# Altium project PCB_Project.PrjPcb
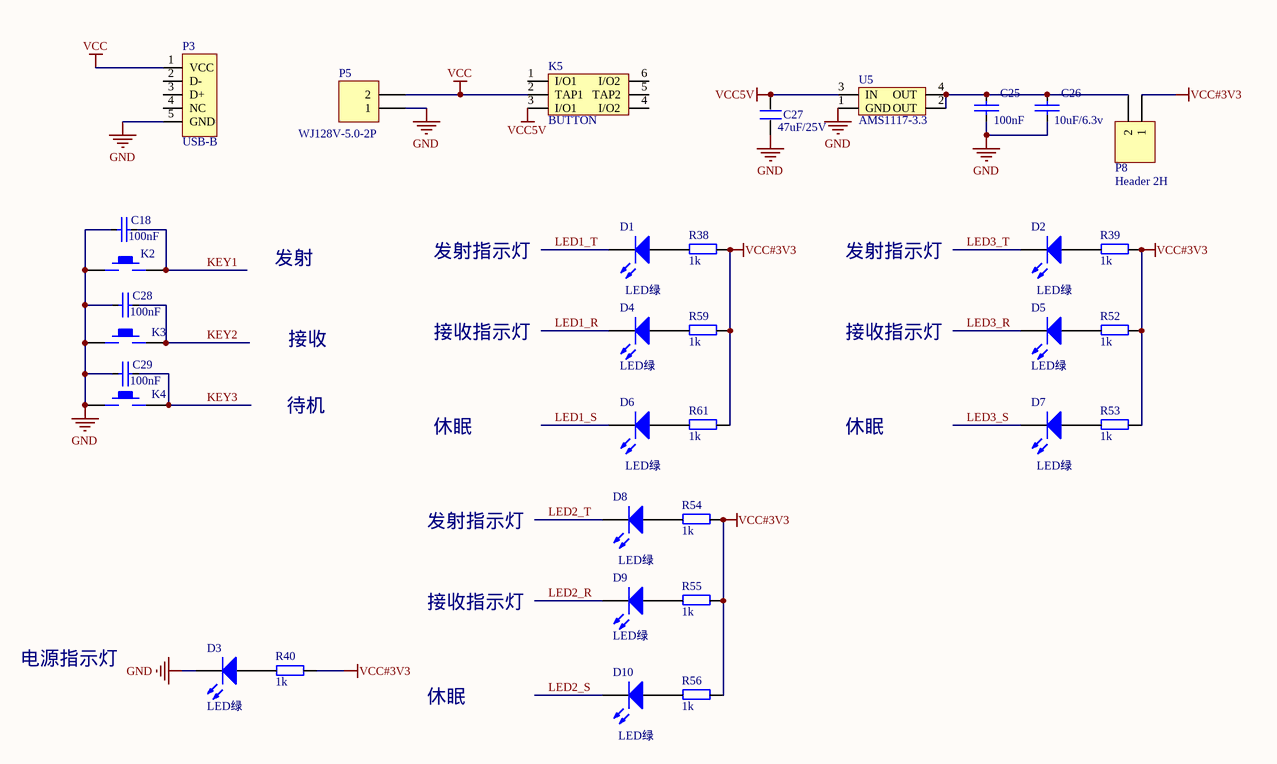
[diagram p0: Mainboard_LoRa   VCC  SCH.SchDoc]
3 sheets, 130 parts. Net scope: global (net labels, ports and power ports of the same name join across sheets).
Board file: Mainboard_LoRa  PCB.PcbDoc
Sheets:
  Mainboard_LoRa   VCC  SCH.SchDoc
  Mainboard_LoRa   MCU SCH.SchDoc
  Mainboard_LoRa   LoRa SCH.SchDoc

## Sheet Mainboard_LoRa   VCC  SCH.SchDoc
size A4

### Parts
(Parts that share a designator on the sheet are numbered #1, #2 ... from top to bottom, then left to right.)
C18#1  100nF  [CAPC_0603_2]
C25#1  100nF  [CAPC_0603_2]
C26#1  10uF/6.3v  [CAPC_0603_2]
C27#1  47uF/25V  [CAPE_D]
C28#1  100nF  [CAPC_0603_2]
C29#1  100nF  [CAPC_0603_2]
D1  LED绿  [LED_0805_G]
D2  LED绿  [LED_0805_G]
D3  LED绿  [LED_0805_G]
D4  LED绿  [LED_0805_G]
D5  LED绿  [LED_0805_G]
D6  LED绿  [LED_0805_G]
D7  LED绿  [LED_0805_G]
D8  LED绿  [LED_0805_G]
D9  LED绿  [LED_0805_G]
D10  LED绿  [LED_0805_G]
K2  K2-1102SP-E4SC-04  [SW_PB_SMD_6X6]  (value not drawn)
K3  K2-1102SP-E4SC-04  [SW_PB_SMD_6X6]  (value not drawn)
K4  K2-1102SP-E4SC-04  [SW_PB_SMD_6X6]  (value not drawn)
K5  BUTTON  [KFT DIP-8X8]
P3  USB-B  [USB_Micro_DIP41]
P5  WJ128V-5.0-2P  [KF128_2P]
P8  Header 2H  [Header 2.54X2]
R38#1  1k  [RESC_0603_2]
R39#1  1k  [RESC_0603_2]
R40#1  1k  [RESC_0603_2]
R52#1  1k  [RESC_0603_2]
R53#1  1k  [RESC_0603_2]
R54#1  1k  [RESC_0603_2]
R55#1  1k  [RESC_0603_2]
R56#1  1k  [RESC_0603_2]
R59  1k  [RESC_0603_2]
R61  1k  [RESC_0603_2]
U5  AMS1117-3.3  [SOT223_3]

### Nets
GND: C18#1.1 C25#1.1 C26#1.1 C27#1.1 C28#1.1 C29#1.1 D3.2(K) K2.1 K3.1 K4.1 P3.5(GND) P5.1 U5.1(GND)
VCC: K5.2(TAP1) P3.1(VCC) P5.2
VCC5V: C27#1.2 K5.3(I/O1) U5.3(IN)
VCC#3V3: P8.1 R38#1.1 R39#1.1 R40#1.1 R52#1.1 R53#1.1 R54#1.1 R55#1.1 R56#1.1 R59.1 R61.1
KEY1: C18#1.2 K2.2
KEY2: C28#1.2 K3.2
KEY3: C29#1.2 K4.2
LED1_R: D4.2(K)
LED1_S: D6.2(K)
LED1_T: D1.2(K)
LED2_R: D9.2(K)
LED2_S: D10.2(K)
LED2_T: D8.2(K)
LED3_R: D5.2(K)
LED3_S: D7.2(K)
LED3_T: D2.2(K)
NetC25#1_2: C25#1.2 C26#1.2 P8.2 U5.2(OUT) U5.4(OUT)
NetD1_1: D1.1(A) R38#1.2
NetD2_1: D2.1(A) R39#1.2
NetD3_1: D3.1(A) R40#1.2
NetD4_1: D4.1(A) R59.2
NetD5_1: D5.1(A) R52#1.2
NetD6_1: D6.1(A) R61.2
NetD7_1: D7.1(A) R53#1.2
NetD8_1: D8.1(A) R54#1.2
NetD9_1: D9.1(A) R55#1.2
NetD10_1: D10.1(A) R56#1.2

Not connected (* = marked no-connect by the designer): K5 1(I/O1) 4(I/O2) 5(TAP2) 6(I/O2); P3 2(D-) 3(D+) 4(NC)

### Notes on the sheet
- 发射指示灯
- 发射
- 接收
- 接收指示灯
- 待机
- 休眠
- 电源指示灯
- 产品名称：
- 图纸编号：
- Size:
- Rev:
- Date:
- Sheet:

### Library data of the parts
C18#1 C25#1 C26#1 C28#1 C29#1 = C: 无极性电容
C27#1 = C
D1-D10 = LED2: Typical RED, GREEN, YELLOW, AMBER GaAs LED; Published: 8-Jun-2000; LatestRevisionDate: 17-Jul-2002; LatestRevisionNote: Re-released for DXP Platform.; PackageDocument: Feb-2002; PackageReference: 3.2X1.6X1.1; Publisher: Altium Limited
K2-K4 = KEY_M
P3 = USB5
P5 P8 = Header 2H: Header, 2-Pin, Right Angle; LatestRevisionDate: 17-Jul-2002; LatestRevisionNote: Re-released for DXP Platform.; Publisher: Altium Limited
R38#1 R39#1 R40#1 R52#1 R53#1 R54#1 R55#1 R56#1 R59 R61 = R
U5 = AMS1117

## Sheet Mainboard_LoRa   MCU SCH.SchDoc
size A4
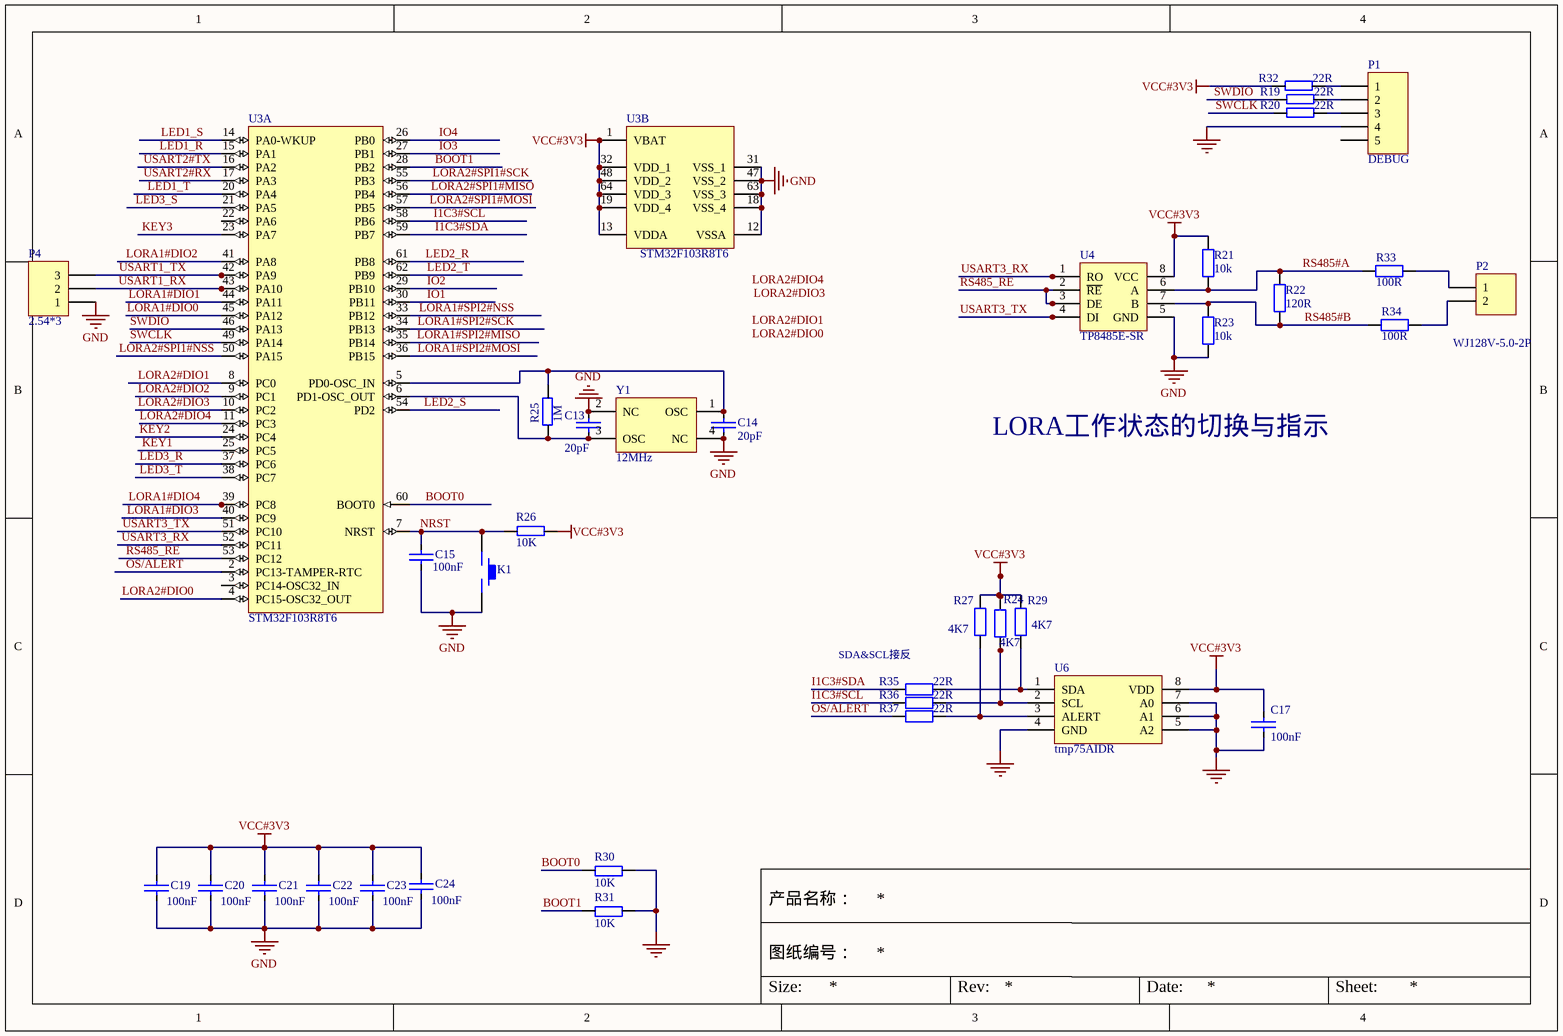
[diagram p1: Mainboard_LoRa   MCU SCH.SchDoc]

### Parts
(Parts that share a designator on the sheet are numbered #1, #2 ... from top to bottom, then left to right.)
C13  20pF  [CAPC_0603_2]
C14#1  20pF  [CAPC_0603_2]
C15#1  100nF  [CAPC_0603_2]
C17#1  100nF  [CAPC_0603_2]
C19  100nF  [CAPC_0603_2]
C20  100nF  [CAPC_0603_2]
C21  100nF  [CAPC_0603_2]
C22  100nF  [CAPC_0603_2]
C23#1  100nF  [CAPC_0603_2]
C24#1  100nF  [CAPC_0603_2]
K1  K2-1102SP-E4SC-04  [SW_PB_SMD_6X6]  (value not drawn)
P1  DEBUG  [Header 2.54X5]
P2  WJ128V-5.0-2P  [KF128_2P]
P4  2.54*3  [Header 2.54X3]
R19#1  22R  [RESC_0603_2]
R20#1  22R  [RESC_0603_2]
R21#1  10k  [RESC_0603_2]
R22#1  120R  [RESC_0603_2]
R23#1  10k  [RESC_0603_2]
R24#1  4K7  [RESC_0603_2]
R25  1M  [RESC_0603_2]
R26  10K  [RESC_0603_2]
R27  4K7  [RESC_0603_2]
R29  4K7  [RESC_0603_2]
R30  10K  [RESC_0603_2]
R31  10K  [RESC_0603_2]
R32  22R  [RESC_0603_2]
R33  100R  [RESC_0603_2]
R34#1  100R  [RESC_0603_2]
R35#1  22R  [RESC_0603_2]
R36#1  22R  [RESC_0603_2]
R37#1  22R  [RESC_0603_2]
U3  STM32F103R8T6  [STM-LQFP64_N]  (parts A,B of 2)
U4  TP8485E-SR  [SOIC_8]
U6#1  tmp75AIDR  [SOIC_8]
Y1  12MHz  [xt3225]

### Nets
GND: C13.1 C14#1.2 C15#1.1 C17#1.2 C19.1 C20.1 C21.1 C22.1 C23#1.1 C24#1.1 K1.2 P1.4 P4.1 R23#1.1 R30.2 R31.2 U3.12(VSSA) U3.18(VSS_4) U3.31(VSS_1) U3.47(VSS_2) U3.63(VSS_3) U4.5(GND) U6#1.4(GND) U6#1.5(A2) U6#1.6(A1) U6#1.7(A0) Y1.2(NC) Y1.4(NC)
VCC#3V3: C17#1.1 C19.2 C20.2 C21.2 C22.2 C23#1.2 C24#1.2 R21#1.2 R24#1.2 R26.1 R27.2 R29.2 R32.2 U3.1(VBAT) U3.13(VDDA) U3.19(VDD_4) U3.32(VDD_1) U3.48(VDD_2) U3.64(VDD_3) U4.8(VCC) U6#1.8(VDD)
BOOT0: R30.1 U3.60(BOOT0)
BOOT1: R31.1 U3.28(PB2)
I1C3#SCL: R36#1.1 U3.58(PB6)
I1C3#SDA: R35#1.1 U3.59(PB7)
IO1: U3.30(PB11)
IO2: U3.29(PB10)
IO3: U3.27(PB1)
IO4: U3.26(PB0)
KEY1: U3.25(PC5)
KEY2: U3.24(PC4)
KEY3: U3.23(PA7)
LED1_R: U3.15(PA1)
LED1_S: U3.14(PA0-WKUP)
LED1_T: U3.20(PA4)
LED2_R: U3.61(PB8)
LED2_S: U3.54(PD2)
LED2_T: U3.62(PB9)
LED3_R: U3.37(PC6)
LED3_S: U3.21(PA5)
LED3_T: U3.38(PC7)
LORA1#DIO0: U3.45(PA12)
LORA1#DIO1: U3.44(PA11)
LORA1#DIO2: U3.41(PA8)
LORA1#DIO3: U3.40(PC9)
LORA1#DIO4: U3.39(PC8)
LORA1#SPI2#MISO: U3.35(PB14)
LORA1#SPI2#MOSI: U3.36(PB15)
LORA1#SPI2#NSS: U3.33(PB12)
LORA1#SPI2#SCK: U3.34(PB13)
LORA2#DIO0: U3.4(PC15-OSC32_OUT)
LORA2#DIO1: U3.8(PC0)
LORA2#DIO2: U3.9(PC1)
LORA2#DIO3: U3.10(PC2)
LORA2#DIO4: U3.11(PC3)
LORA2#SPI1#MISO: U3.56(PB4)
LORA2#SPI1#MOSI: U3.57(PB5)
LORA2#SPI1#NSS: U3.50(PA15)
LORA2#SPI1#SCK: U3.55(PB3)
NRST: C15#1.2 K1.1 R26.2 U3.7(NRST)
OS/ALERT: R37#1.1 U3.2(PC13-TAMPER-RTC)
RS485#A: R21#1.1 R22#1.2 R33.2 U4.6(A)
RS485#B: R22#1.1 R23#1.2 R34#1.2 U4.7(B)
RS485_RE: U3.53(PC12) U4.2(~{RE}) U4.3(DE)
SWCLK: R20#1.2 U3.49(PA14)
SWDIO: R19#1.2 U3.46(PA13)
USART1_RX: P4.2 U3.43(PA10)
USART1_TX: P4.3 U3.42(PA9)
USART2#RX: U3.17(PA3)
USART2#TX: U3.16(PA2)
USART3_RX: U3.52(PC11) U4.1(RO)
USART3_TX: U3.51(PC10) U4.4(DI)
NetC13_2: C13.2 R25.2 U3.6(PD1-OSC_OUT) Y1.3(OSC)
NetC14#1_1: C14#1.1 R25.1 U3.5(PD0-OSC_IN) Y1.1(OSC)
NetP1_1: P1.1 R32.1
NetP1_2: P1.2 R19#1.1
NetP1_3: P1.3 R20#1.1
NetP2_1: P2.1 R33.1
NetP2_2: P2.2 R34#1.1
NetR24#1_1: R24#1.1 R36#1.2 U6#1.2(SCL)
NetR27_1: R27.1 R37#1.2 U6#1.3(ALERT)
NetR29_1: R29.1 R35#1.2 U6#1.1(SDA)

Not connected (* = marked no-connect by the designer): P1 5; U3 3(PC14-OSC32_IN) 22(PA6)

### Notes on the sheet
- LORA工作状态的切换与指示
- SDA&SCL接反
- Labels drawn without touching a wire or pin: LORA2#DIO0, LORA2#DIO1, LORA2#DIO3, LORA2#DIO4
- 产品名称：
- 图纸编号：
- Size:
- Rev:
- Date:
- Sheet:

### Library data of the parts
C13 C14#1 C15#1 C17#1 C19-C22 C23#1 C24#1 = C: 无极性电容
K1 = KEY_M
P1 = Header 5: Header, 5-Pin; LatestRevisionDate: 17-Jul-2002; LatestRevisionNote: Re-released for DXP Platform.; Publisher: Altium Limited
P2 = Header 2H: Header, 2-Pin, Right Angle; LatestRevisionDate: 17-Jul-2002; LatestRevisionNote: Re-released for DXP Platform.; Publisher: Altium Limited
P4 = Header 3H: Header, 3-Pin, Right Angle; LatestRevisionDate: 17-Jul-2002; LatestRevisionNote: Re-released for DXP Platform.; Publisher: Altium Limited
R19#1 R20#1 R25 R26 R30-R32 = R
R21#1 R22#1 R23#1 R24#1 R27 R29 R33 R34#1 R35#1 R36#1 R37#1 = R: Resistor; Published: 8-Jun-2000; LatestRevisionDate: 17-Jul-2002; LatestRevisionNote: Re-released for DXP Platform.; PackageReference: AXIAL-0.4; Publisher: Altium Limited; PackageDescription: Axial Device, Thru-Hole; 2 Leads; 0.4 in Pin Spacing
U3 = STM32F103R8T6: ARM Cortex-M3 32-bit MCU, 64 KB Flash, 20 KB Internal RAM, 51 I/Os, 64-pin LQFP, -40 to 85 degC, Tray; A/D Converter: 2x12-bit (16 Channel); FLASH Size (Prog) (kB): 64; I/Os (High Current): 51; Internal RAM Size (kB): 20; Operating Frequency(F) (Processor speed) (MHz): 72; Supply Voltage(Vcc) min (V): 2; DatasheetVersion: Rev. 16; PackageVersion: Rev. 4, 06/2013; PackageReference: LQFP64; PackageDescription: 64-Pin Low Profile Quad Flat Package, 10 x 10 mm Body, 0.5 mm Pitch; Supplier 1: Digi-Key; Supplier Part Number 1: 497-6065-ND; Supplier 2: Farnell; Supplier Part Number 2: 1447638; Supplier 3: Newark; Supplier Part Number 3: 57P1241; Supplier 4: Mouser; Supplier Part Number 4: 511-STM32F103R8T6; Core: ARM Cortex-M3; Packing: Tray; Mounting Technology: Surface Mount; PartNumber: STM32F103R8T6; ComponentLink1Description: Manufacturer URL; ComponentLink1URL: http://www.st.com/web/en/home.html; ComponentLink2Description: Datasheet; ComponentLink2URL: http://www.st.com/st-web-ui/static/active/en/resource/technical/document/datasheet/CD00161566.pdf; ComponentLink3Description: Package Specification; ComponentLink3URL: http://www.st.com/st-web-ui/static/active/en/resource/technical/document/datasheet/DM00037051.pdf
U4 = SP485
Y1 = XTAL-WY

## Sheet Mainboard_LoRa   LoRa SCH.SchDoc
size A4
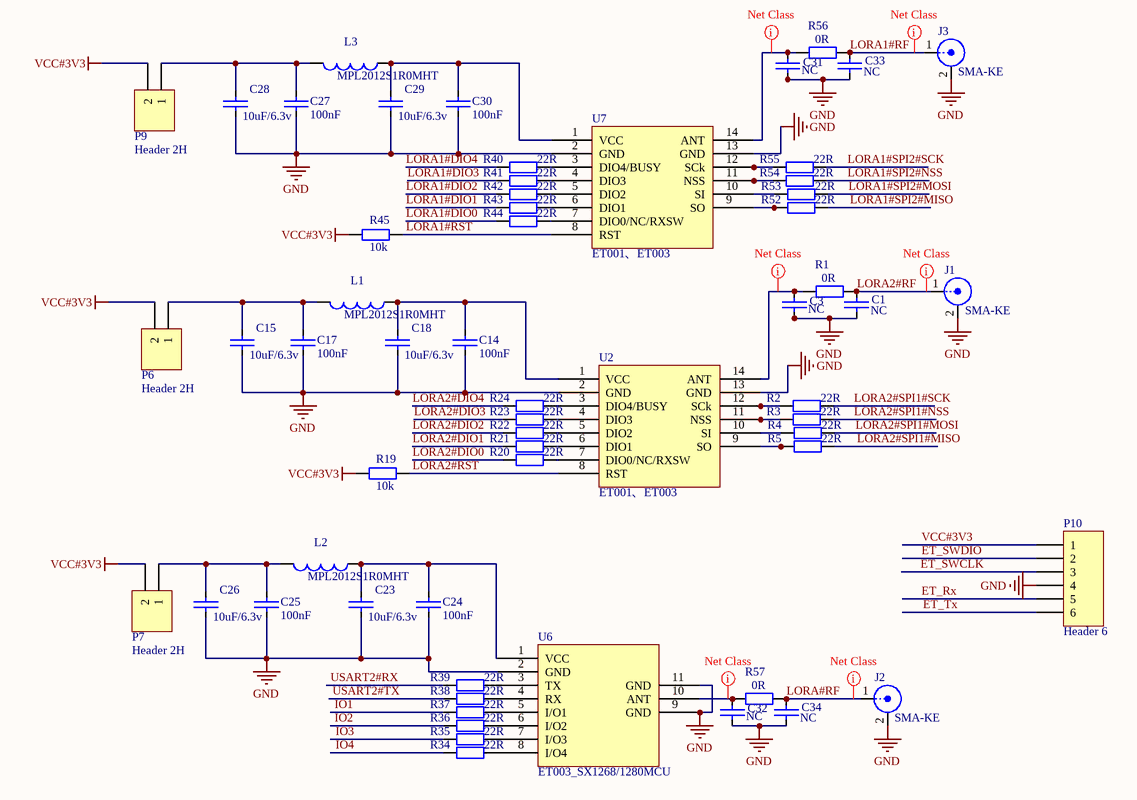
[diagram p2: Mainboard_LoRa   LoRa SCH.SchDoc]

### Parts
(Parts that share a designator on the sheet are numbered #1, #2 ... from top to bottom, then left to right.)
C1  NC  [CAPC_0603_2]
C3  NC  [CAPC_0603_2]
C14#2  100nF  [CAPC_0603_2]
C15#2  10uF/6.3v  [CAPC_0603_2]
C17#2  100nF  [CAPC_0603_2]
C18#2  10uF/6.3v  [CAPC_0603_2]
C23#2  10uF/6.3v  [CAPC_0603_2]
C24#2  100nF  [CAPC_0603_2]
C25#2  100nF  [CAPC_0603_2]
C26#2  10uF/6.3v  [CAPC_0603_2]
C27#2  100nF  [CAPC_0603_2]
C28#2  10uF/6.3v  [CAPC_0603_2]
C29#2  10uF/6.3v  [CAPC_0603_2]
C30  100nF  [CAPC_0603_2]
C31  NC  [CAPC_0603_2]
C32  NC  [CAPC_0603_2]
C33  NC  [CAPC_0603_2]
C34  NC  [CAPC_0603_2]
J1  SMA-KE  [SMARA]
J2  SMA-KE  [SMARA]
J3  SMA-KE  [SMARA]
L1  MPL2012S1R0MHT  [Inductor_0805]
L2  MPL2012S1R0MHT  [Inductor_0805]
L3  MPL2012S1R0MHT  [Inductor_0805]
P6  Header 2H  [Header 2.54X2]
P7  Header 2H  [Header 2.54X2]
P9  Header 2H  [Header 2.54X2]
P10  Header 6  [Header 2.54X6]
R1  0R  [RESC_0603_2]
R2  22R  [RESC_0603_2]
R3  22R  [RESC_0603_2]
R4  22R  [RESC_0603_2]
R5  22R  [RESC_0603_2]
R19#2  10k  [RESC_0603_2]
R20#2  22R  [RESC_0603_2]
R21#2  22R  [RESC_0603_2]
R22#2  22R  [RESC_0603_2]
R23#2  22R  [RESC_0603_2]
R24#2  22R  [RESC_0603_2]
R34#2  22R  [RESC_0603_2]
R35#2  22R  [RESC_0603_2]
R36#2  22R  [RESC_0603_2]
R37#2  22R  [RESC_0603_2]
R38#2  22R  [RESC_0603_2]
R39#2  22R  [RESC_0603_2]
R40#2  22R  [RESC_0603_2]
R41  22R  [RESC_0603_2]
R42  22R  [RESC_0603_2]
R43  22R  [RESC_0603_2]
R44  22R  [RESC_0603_2]
R45  10k  [RESC_0603_2]
R52#2  22R  [RESC_0603_2]
R53#2  22R  [RESC_0603_2]
R54#2  22R  [RESC_0603_2]
R55#2  22R  [RESC_0603_2]
R56#2  0R  [RESC_0603_2]
R57  0R  [RESC_0603_2]
U2  ET001、ET003  [ET001]
U6#2  ET003_SX1268/1280MCU  [ET001/3_MCU]
U7  ET001、ET003  [ET001]

### Nets
GND: C1.1 C3.1 C14#2.2 C15#2.1 C17#2.2 C18#2.1 C23#2.1 C24#2.2 C25#2.2 C26#2.1 C27#2.2 C28#2.1 C29#2.1 C30.2 C31.1 C32.1 C33.1 C34.1 J1.2(Y) J2.2(Y) J3.2(Y) P10.4 U2.2(GND) U2.13(GND) U6#2.2(GND) U6#2.9(GND) U6#2.11(GND) U7.2(GND) U7.13(GND)
VCC#3V3: P6.2 P7.2 P9.2 P10.1 R19#2.1 R45.1
ET_Rx: P10.5
ET_SWCLK: P10.3
ET_SWDIO: P10.2
ET_Tx: P10.6
IO1: R37#2.1
IO2: R36#2.1
IO3: R35#2.1
IO4: R34#2.1
LORA1#DIO0: R44.1
LORA1#DIO1: R43.1
LORA1#DIO2: R42.1
LORA1#DIO3: R41.1
LORA1#DIO4: R40#2.1
LORA1#RF: C33.2 J3.1(X) R56#2.2
LORA1#RST: R45.2 U7.8(RST)
LORA1#SPI2#MISO: R52#2.2
LORA1#SPI2#MOSI: R53#2.2
LORA1#SPI2#NSS: R54#2.2
LORA1#SPI2#SCK: R55#2.2
LORA2#DIO0: R20#2.1
LORA2#DIO1: R21#2.1
LORA2#DIO2: R22#2.1
LORA2#DIO3: R23#2.1
LORA2#DIO4: R24#2.1
LORA2#RF: C1.2 J1.1(X) R1.2
LORA2#RST: R19#2.2 U2.8(RST)
LORA2#SPI1#MISO: R5.2
LORA2#SPI1#MOSI: R4.2
LORA2#SPI1#NSS: R3.2
LORA2#SPI1#SCK: R2.2
LORA#RF: C34.2 J2.1(X) R57.2
USART2#RX: R39#2.1
USART2#TX: R38#2.1
NetC3_2: C3.2 R1.1 U2.14(ANT)
NetC14#2_1: C14#2.1 C18#2.2 L1.1 U2.1(VCC)
NetC15#2_2: C15#2.2 C17#2.1 L1.2 P6.1
NetC23#2_2: C23#2.2 C24#2.1 L2.1 U6#2.1(VCC)
NetC25#2_1: C25#2.1 C26#2.2 L2.2 P7.1
NetC27#2_1: C27#2.1 C28#2.2 L3.2 P9.1
NetC29#2_2: C29#2.2 C30.1 L3.1 U7.1(VCC)
NetC31_2: C31.2 R56#2.1 U7.14(ANT)
NetC32_2: C32.2 R57.1 U6#2.10(ANT)
NetR2_1: R2.1 U2.12(SCk)
NetR3_1: R3.1 U2.11(NSS)
NetR4_1: R4.1 U2.10(SI)
NetR5_1: R5.1 U2.9(SO)
NetR20#2_2: R20#2.2 U2.7(DIO0/NC/RXSW)
NetR21#2_2: R21#2.2 U2.6(DIO1)
NetR22#2_2: R22#2.2 U2.5(DIO2)
NetR23#2_2: R23#2.2 U2.4(DIO3)
NetR24#2_2: R24#2.2 U2.3(DIO4/BUSY)
NetR34#2_2: R34#2.2 U6#2.8(I/O4)
NetR35#2_2: R35#2.2 U6#2.7(I/O3)
NetR36#2_2: R36#2.2 U6#2.6(I/O2)
NetR37#2_2: R37#2.2 U6#2.5(I/O1)
NetR38#2_2: R38#2.2 U6#2.4(RX)
NetR39#2_2: R39#2.2 U6#2.3(TX)
NetR40#2_2: R40#2.2 U7.3(DIO4/BUSY)
NetR41_2: R41.2 U7.4(DIO3)
NetR42_2: R42.2 U7.5(DIO2)
NetR43_2: R43.2 U7.6(DIO1)
NetR44_2: R44.2 U7.7(DIO0/NC/RXSW)
NetR52#2_1: R52#2.1 U7.9(SO)
NetR53#2_1: R53#2.1 U7.10(SI)
NetR54#2_1: R54#2.1 U7.11(NSS)
NetR55#2_1: R55#2.1 U7.12(SCk)

### Layout directives
net class RF: LORA1#RF, LORA2#RF, LORA#RF, NetC3_2, NetC31_2, NetC32_2

### Notes on the sheet
- 产品名称：
- 图纸编号：
- Size:
- Rev:
- Date:
- Sheet:

### Library data of the parts
C1 C3 C14#2 C15#2 C17#2 C18#2 C23#2 C24#2 C25#2 C26#2 C27#2 C28#2 C29#2 C30-C34 = C: 无极性电容
J1-J3 = SMB: SMB Straight Connector; LatestRevisionDate: 17-Jul-2002; LatestRevisionNote: Re-released for DXP Platform.; Publisher: Altium Limited
L1-L3 = Inductor: Inductor  footprint4026; Code_IEC: 1005; Published: 8-Jun-2000; LatestRevisionDate: 17-Jul-2002; LatestRevisionNote: Re-released for DXP Platform.; PackageReference: 0402-A; Publisher: Altium Limited; Code_JEITA: 0402
P6 P7 P9 = Header 2H: Header, 2-Pin, Right Angle; LatestRevisionDate: 17-Jul-2002; LatestRevisionNote: Re-released for DXP Platform.; Publisher: Altium Limited
P10 = Header 6: Header, 6-Pin; LatestRevisionDate: 17-Jul-2002; LatestRevisionNote: Re-released for DXP Platform.; Publisher: Altium Limited
R1-R5 R19#2 R20#2 R21#2 R22#2 R23#2 R24#2 R34#2 R35#2 R36#2 R37#2 R38#2 R39#2 R40#2 R41-R45 R52#2 R53#2 R54#2 R55#2 R56#2 R57 = R: Resistor
  R2-R5 R19#2 R20#2 R21#2 R22#2 R23#2 R24#2 R34#2 R35#2 R36#2 R37#2 R38#2 R39#2 R40#2 R41-R45 R52#2 R53#2 R54#2 R55#2: Published: 8-Jun-2000; LatestRevisionDate: 17-Jul-2002; LatestRevisionNote: Re-released for DXP Platform.; PackageReference: AXIAL-0.4; Publisher: Altium Limited; PackageDescription: Axial Device, Thru-Hole; 2 Leads; 0.4 in Pin Spacing
U2 U7 = SX_1278/1268/1280
U6#2 = ET001/3_MCU

## Nets that join several sheets
GND: Mainboard_LoRa   VCC  SCH (13 pins), Mainboard_LoRa   MCU SCH (28 pins), Mainboard_LoRa   LoRa SCH (29 pins)
VCC#3V3: Mainboard_LoRa   VCC  SCH (11 pins), Mainboard_LoRa   MCU SCH (21 pins), Mainboard_LoRa   LoRa SCH (6 pins)
IO1: Mainboard_LoRa   MCU SCH (U3.30), Mainboard_LoRa   LoRa SCH (R37#2.1)
IO2: Mainboard_LoRa   MCU SCH (U3.29), Mainboard_LoRa   LoRa SCH (R36#2.1)
IO3: Mainboard_LoRa   MCU SCH (U3.27), Mainboard_LoRa   LoRa SCH (R35#2.1)
IO4: Mainboard_LoRa   MCU SCH (U3.26), Mainboard_LoRa   LoRa SCH (R34#2.1)
KEY1: Mainboard_LoRa   VCC  SCH (C18#1.2 K2.2), Mainboard_LoRa   MCU SCH (U3.25)
KEY2: Mainboard_LoRa   VCC  SCH (C28#1.2 K3.2), Mainboard_LoRa   MCU SCH (U3.24)
KEY3: Mainboard_LoRa   VCC  SCH (C29#1.2 K4.2), Mainboard_LoRa   MCU SCH (U3.23)
LED1_R: Mainboard_LoRa   VCC  SCH (D4.2), Mainboard_LoRa   MCU SCH (U3.15)
LED1_S: Mainboard_LoRa   VCC  SCH (D6.2), Mainboard_LoRa   MCU SCH (U3.14)
LED1_T: Mainboard_LoRa   VCC  SCH (D1.2), Mainboard_LoRa   MCU SCH (U3.20)
LED2_R: Mainboard_LoRa   VCC  SCH (D9.2), Mainboard_LoRa   MCU SCH (U3.61)
LED2_S: Mainboard_LoRa   VCC  SCH (D10.2), Mainboard_LoRa   MCU SCH (U3.54)
LED2_T: Mainboard_LoRa   VCC  SCH (D8.2), Mainboard_LoRa   MCU SCH (U3.62)
LED3_R: Mainboard_LoRa   VCC  SCH (D5.2), Mainboard_LoRa   MCU SCH (U3.37)
LED3_S: Mainboard_LoRa   VCC  SCH (D7.2), Mainboard_LoRa   MCU SCH (U3.21)
LED3_T: Mainboard_LoRa   VCC  SCH (D2.2), Mainboard_LoRa   MCU SCH (U3.38)
LORA1#DIO0: Mainboard_LoRa   MCU SCH (U3.45), Mainboard_LoRa   LoRa SCH (R44.1)
LORA1#DIO1: Mainboard_LoRa   MCU SCH (U3.44), Mainboard_LoRa   LoRa SCH (R43.1)
LORA1#DIO2: Mainboard_LoRa   MCU SCH (U3.41), Mainboard_LoRa   LoRa SCH (R42.1)
LORA1#DIO3: Mainboard_LoRa   MCU SCH (U3.40), Mainboard_LoRa   LoRa SCH (R41.1)
LORA1#DIO4: Mainboard_LoRa   MCU SCH (U3.39), Mainboard_LoRa   LoRa SCH (R40#2.1)
LORA1#SPI2#MISO: Mainboard_LoRa   MCU SCH (U3.35), Mainboard_LoRa   LoRa SCH (R52#2.2)
LORA1#SPI2#MOSI: Mainboard_LoRa   MCU SCH (U3.36), Mainboard_LoRa   LoRa SCH (R53#2.2)
LORA1#SPI2#NSS: Mainboard_LoRa   MCU SCH (U3.33), Mainboard_LoRa   LoRa SCH (R54#2.2)
LORA1#SPI2#SCK: Mainboard_LoRa   MCU SCH (U3.34), Mainboard_LoRa   LoRa SCH (R55#2.2)
LORA2#DIO0: Mainboard_LoRa   MCU SCH (U3.4), Mainboard_LoRa   LoRa SCH (R20#2.1)
LORA2#DIO1: Mainboard_LoRa   MCU SCH (U3.8), Mainboard_LoRa   LoRa SCH (R21#2.1)
LORA2#DIO2: Mainboard_LoRa   MCU SCH (U3.9), Mainboard_LoRa   LoRa SCH (R22#2.1)
LORA2#DIO3: Mainboard_LoRa   MCU SCH (U3.10), Mainboard_LoRa   LoRa SCH (R23#2.1)
LORA2#DIO4: Mainboard_LoRa   MCU SCH (U3.11), Mainboard_LoRa   LoRa SCH (R24#2.1)
LORA2#SPI1#MISO: Mainboard_LoRa   MCU SCH (U3.56), Mainboard_LoRa   LoRa SCH (R5.2)
LORA2#SPI1#MOSI: Mainboard_LoRa   MCU SCH (U3.57), Mainboard_LoRa   LoRa SCH (R4.2)
LORA2#SPI1#NSS: Mainboard_LoRa   MCU SCH (U3.50), Mainboard_LoRa   LoRa SCH (R3.2)
LORA2#SPI1#SCK: Mainboard_LoRa   MCU SCH (U3.55), Mainboard_LoRa   LoRa SCH (R2.2)
USART2#RX: Mainboard_LoRa   MCU SCH (U3.17), Mainboard_LoRa   LoRa SCH (R39#2.1)
USART2#TX: Mainboard_LoRa   MCU SCH (U3.16), Mainboard_LoRa   LoRa SCH (R38#2.1)